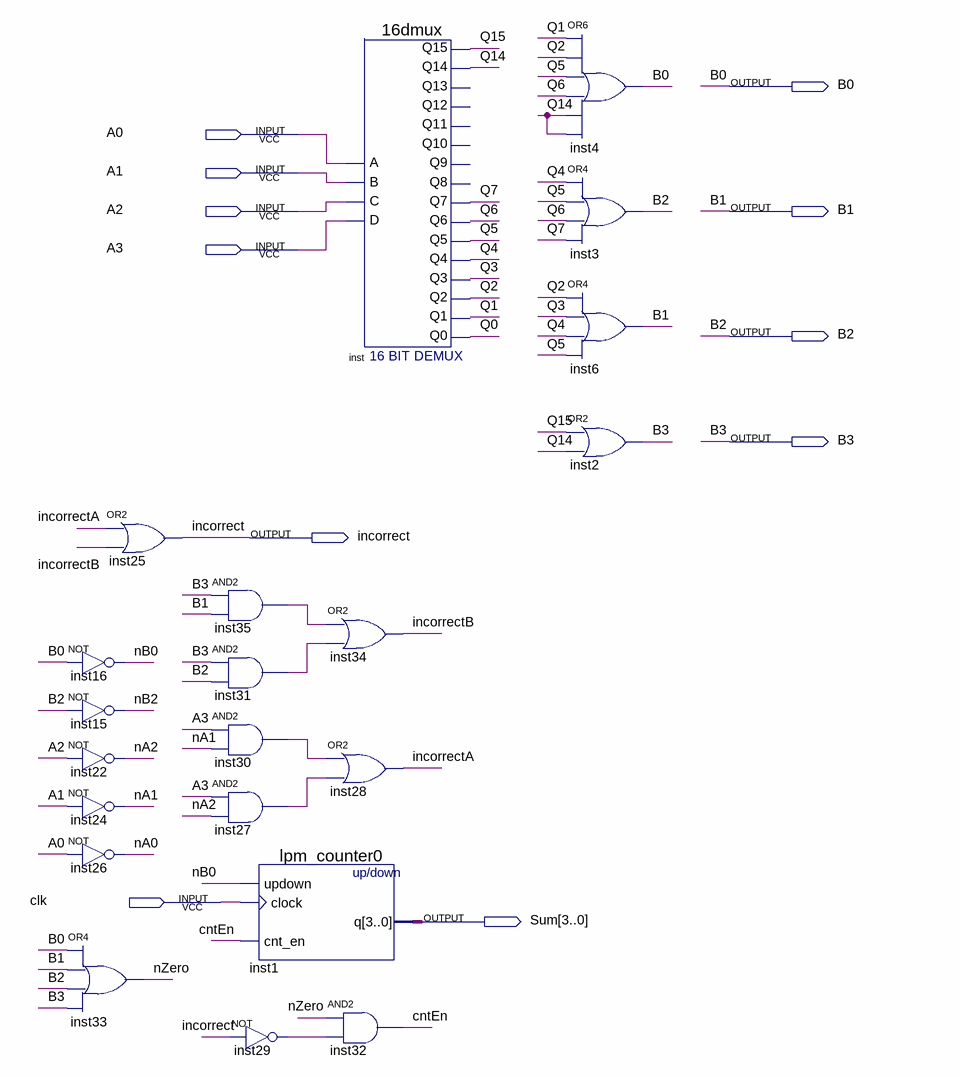
[diagram p0: schematic sheet]
// Quartus schematic kurs_sxem13.bdf as structural Verilog: 21 symbols, 11 pins
module kurs_sxem13 (
  input  A0,
  input  A1,
  input  A2,
  input  A3,
  input  clk,
  output B0,
  output B1,
  output B2,
  output B3,
  output incorrect,
  output [3:0] Sum
);

  wire cntEn, incorrectA, incorrectB, inst27_out, inst29_out, inst30_out, inst31_out, inst35_out, nA0, nA1,
       nA2, nB0, nB2, nZero, Q0, Q1, Q2, Q3, Q4, Q5, Q6, Q7, Q14, Q15;

  or inst25 (incorrect, incorrectA, incorrectB);
  not inst16 (nB0, B0);
  not inst15 (nB2, B2);
  not inst22 (nA2, A2);
  not inst24 (nA1, A1);
  not inst26 (nA0, A0);
  or inst33 (nZero, B0, B1, B2, B3);
  and inst35 (inst35_out, B3, B1);
  and inst31 (inst31_out, B3, B2);
  and inst30 (inst30_out, A3, nA1);
  and inst27 (inst27_out, A3, nA2);
  lpm_counter0 inst1 (.updown(nB0), .clock(clk), .cnt_en(cntEn), .q(Sum));
  not inst29 (inst29_out, incorrect);
  or inst34 (incorrectB, inst35_out, inst31_out);
  or inst28 (incorrectA, inst30_out, inst27_out);
  and inst32 (cntEn, nZero, inst29_out);
  \16dmux  inst (
    .C(A2), .B(A1), .A(A0), .D(A3), .Q7(Q7), .Q4(Q4), .Q5(Q5), .Q6(Q6), .Q2(Q2), .Q3(Q3), .Q14(Q14),
    .Q15(Q15), .Q0(Q0), .Q1(Q1));  // open: Q12, Q13, Q11, Q9, Q10, Q8
  or inst4 (B0, Q1, Q2, Q5, Q6, Q14, Q14);
  or inst3 (B2, Q4, Q5, Q6, Q7);
  or inst6 (B1, Q2, Q3, Q4, Q5);
  or inst2 (B3, Q15, Q14);
endmodule
